# Altium schematic sheet Schematic.SchDoc
size A; SheetNumber: 1; SheetTotal: 1
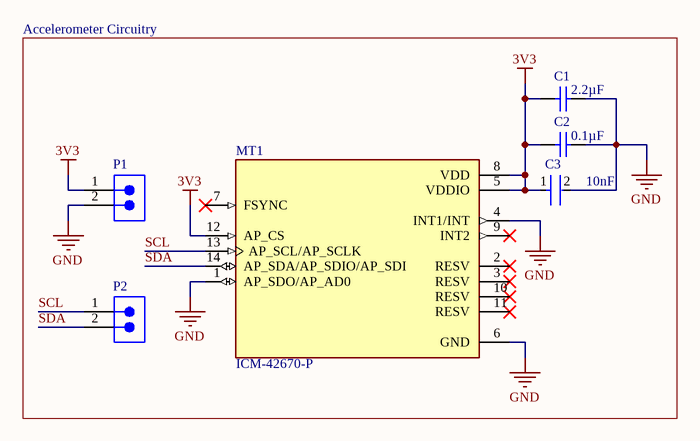
[diagram p0: Schematic.SchDoc]

## Parts
C1  2.2µF  [CAPC3216X180X50LL20T25]
C2  0.1µF  [CAPC3216X100X50LL20T25]
C3  10nF  [FP-C1206C-EB-MFG]
MT1  ICM-42670-P  [XDCR_ICM-42670-P]
P1  61300211121  [61300211121]  (value not drawn)
P2  61300211121  [61300211121]  (value not drawn)

## Blocks framed on the sheet
Accelerometer Circuitry: C1-C3 MT1 P1 P2

## Nets
3V3: C1.2 C2.2 C3.1 MT1.5(VDDIO) MT1.8(VDD) MT1.12(AP_CS) P1.1
GND: C1.1 C2.1 C3.2 MT1.1(AP_SDO/AP_AD0) MT1.4(INT1/INT) MT1.6(GND) P1.2
SCL: MT1.13(AP_SCL/AP_SCLK) P2.1
SDA: MT1.14(AP_SDA/AP_SDIO/AP_SDI) P2.2

Not connected (* = marked no-connect by the designer): MT1 2(RESV)* 3(RESV)* 7(FSYNC)* 9(INT2)* 10(RESV)* 11(RESV)*

## Library data of the parts
C1 = CMP-1037-04831-2: Chip Capacitor, 2.2 uF, +/- 10%, 50 V, -55 to 125 degC, 1206 (3216 Metric), RoHS, Tape and Reel; Manufacturer: Kemet; Case Width: 1.6mm; Capacitance - nF: 2200nF; Capacitance: 2.2uF; Class: Class1; Type: SMDMLCCX7R6.3-250VDCCommericalGrade; Voltage Rating: 50V; Case Length: 3.2mm; Dielectric: X7R; Temperature Coefficient / Code: +/-15%; Product Category: MultilayerCeramicCapacitorsMLCC-SMD/SMT; Package Description: 2-Pin Surface Mount Device, Body 3.2 x 1.6 mm; Minimum Operating Temperature: -55C; RoHS: Details; Package / Case: 1206(3216metric); Packaging: Reel; Case Code - mm: 3216; Datasheet Version: 02/2016; Tolerance: 10%; Series: C1206C; Dimensions: 1.6mmWx3.2mmLx1.6mmH; Case Height: 1.6mm; Brand: Kemet; Mounting Technology: SurfaceMount; Manufacturer URL: http://www.kemet.com/; Voltage Rating DC: 50V; Datasheet URL: http://www.kemet.com/docfinder?Partnumber=C1206C225K5RACTU; Maximum Operating Temperature: +125C; Case Code - in: 1206; Package Reference: 1206; Termination Style: SMD/SMT; Operating Temperature Range: -55Cto+125C; Product: GeneralTypeMLCCs; Factory Pack Quantity: 2000
C2 = CMP-1664-00001-4: Chip Capacitor, 100 nF, +/- 10%, 25 V, -55 to 125 degC, 1206 (3216 Metric), RoHS, Tape and Reel; Manufacturer: Kemet; Voltage Rating: 25 V; ComponentLink1URL: http://www.kemet.com/; Max Operating Temperature: 125 degC; PackageReference: 1206; ComponentLink2URL: http://www.kemet.com/docfinder?Partnumber=C1206F104K3RACTU; ComponentLink1Description: Manufacturer URL; ComponentLink2Description: Datasheet; Length: 3.2 mm; Packaging: Tape and Reel; Height: 0.78 mm; Mounting Technology: Surface Mount; REACH SVHC: No SVHC; PackageDescription: 2-Pin Surface Mount Device, Body 3.2 x 1.6 mm; Min Operating Temperature: -55 degC; RoHSCompliant: true; DatasheetVersion: 02/2016; Package Quantity: 4000
C3 = CMP-03020-003656-1: CAP CER 10000PF 100V X7R 1206; Manufacturer: KEMET; Manufacturer Part Number: C1206C103J1RACTU; Temperature Coefficient: 15%; Capacitance: 10,000 pF; Automotive Grade: Grade 0; Value: 10,000 pF; Material: Ceramic; Tolerance: 0.05; Digikey Description: CAP CER 10000PF 100V X7R 1206; Temperature Range Low: -55°C; Height: 0.88mm; Automotive: Yes; Ipc Land Pattern Name: CAPC320160X78; ComponentLink2URL: https://content.kemet.com/datasheets/KEM_C1007_X8R_ULTRA_150C_SMD.pdf; Device Class L2: Capacitors; Mouser Description: 1206 C 10nF Ceramic Multilayer Capacitor, 100 VDC, +125degC, X7R Dielec, +/-5%; Octopart: https://octopart.com/c1206c103j1ractu-kemet-121270; Category: Cap; Temperature Characteristic: X7R; Voltage Rating: 100 V; Temperature: -55°C to +150°C; Device Class L1: Passive Components; RoHS: TRUE; Device Class L3: Ceramic Capacitors; Package: C1206C-EB; Lead Free: Yes; ComponentLink2Description: Datasheet; Temperature Range High: +150°C
P1 P2 = CMP-1712-00002-6: NexarPartId: 20081794; Number of Contacts: 2; Pitch: 2.54mm; Connector Type: Male Pin; Voltage Rating: 250V; Current Rating: 3A; Gender: Male; Contact Resistance: 20mΩ; Height: 8.94mm; Lead Free: Lead Free; Number of Pins: 2; Termination: Through Hole; RoHS: Compliant; Lead Pitch: 2.54mm; REACH SVHC: No SVHC; Housing Material: PBT; Contact Mating Length: 5.9944mm; Min Operating Temperature: -40°C; Orientation: Vertical; Contact Material: Copper; Contact Gender: Male; Max Operating Temperature: 125°C; Number of Rows: 1; Number of Positions: 2; Packaging: Bulk; Contact Plating: Gold; Mount: Through Hole; Color: Black; Operating Supply Voltage: 250V
MT1 = ICM-42670-P: Package: None; Price: None; Value: *; MP: ICM-42670-P; Availability: Unavailable